# Altium project FMCW-Radar-v1.PrjPcb (part 3 of 3)

## Sheet MCU.SchDoc
size B; SheetNumber: 4; SheetTotal: 4
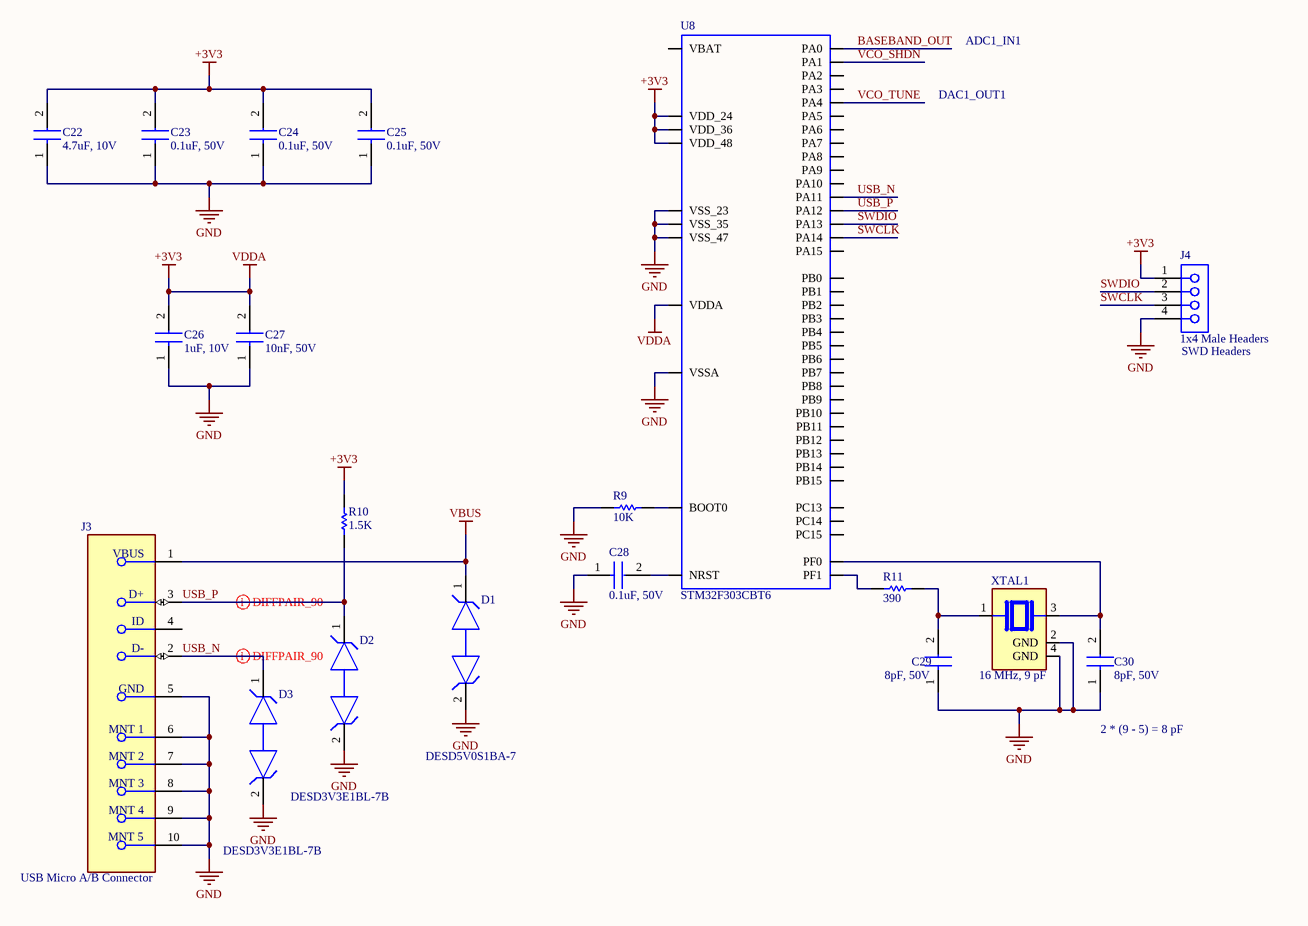
[diagram p3: MCU.SchDoc]

### Parts
C22  4.7uF, 10V  [CAPC1608X90N]
C23  0.1uF, 50V  [CAP_CC0603_YAG-M]
C24  0.1uF, 50V  [CAP_CC0603_YAG-M]
C25  0.1uF, 50V  [CAP_CC0603_YAG-M]
C26  1uF, 10V  [FP-CL10-IPC_A]
C27  10nF, 50V  [CAPC10555_55N_KEM]
C28  0.1uF, 50V  [CAP_CC0603_YAG-M]
C29  8pF, 50V  [CAPC1005X55N]
C30  8pF, 50V  [CAPC1005X55N]
D1  DESD5V0S1BA-7  [FP-SOD323-IPC_C]
D2  DESD3V3E1BL-7B  [CR_X1-DFN1006-2_DIO]
D3  DESD3V3E1BL-7B  [CR_X1-DFN1006-2_DIO]
J3  USB Micro A/B Connector  [FP-47590-0001-MFG]
J4  1x4 Male Headers  [61300411121]
R9  10K  [RESC1005X37N]
R10  1.5K  [RESC1005X40N]
R11  390  [RESC1005X40N]
U8  STM32F303CBT6  [LQFP-48]
XTAL1  16 MHz, 9 pF  [XTAL_TSX-3225_16.0000MF18X-AC0]

### Nets
+3V3: C22.2 C23.2 C24.2 C25.2 C26.2 C27.2 J4.1 R10.1 U8.9(VDDA) U8.24(VDD_24) U8.36(VDD_36) U8.48(VDD_48)  [also labelled VDDA]
GND: C22.1 C23.1 C24.1 C25.1 C26.1 C27.1 C28.1 C29.1 C30.1 D1.2 D2.2 D3.2 J3.5(GND) J3.6(MNT_1) J3.7(MNT_2) J3.8(MNT_3) J3.9(MNT_4) J3.10(MNT_5) J4.4 R9.1 U8.8(VSSA) U8.23(VSS_23) U8.35(VSS_35) U8.47(VSS_47) XTAL1.2(GND) XTAL1.4(GND)
VBUS: D1.1 J3.1(VBUS)
BASEBAND_OUT: U8.10(PA0)
SWCLK: J4.3 U8.37(PA14)
SWDIO: J4.2 U8.34(PA13)
USB_N: D3.1 J3.2(D-) U8.32(PA11)
USB_P: D2.1 J3.3(D+) R10.2 U8.33(PA12)
VCO_SHDN: U8.11(PA1)
VCO_TUNE: U8.14(PA4)
NetC28_2: C28.2 U8.7(NRST)
NetC29_2: C29.2 R11.2 XTAL1.1
NetC30_2: C30.2 U8.5(PF0) XTAL1.3
NetR9_2: R9.2 U8.44(BOOT0)
NetR11_1: R11.1 U8.6(PF1)

Not connected (* = marked no-connect by the designer): J3 4(ID); U8 1(VBAT) 2(PC13) 3(PC14) 4(PC15) 12(PA2) 13(PA3) 15(PA5) 16(PA6) 17(PA7) 18(PB0) 19(PB1) 20(PB2) 21(PB10) 22(PB11) 25(PB12) 26(PB13) 27(PB14) 28(PB15) 29(PA8) 30(PA9) 31(PA10) 38(PA15) 39(PB3) 40(PB4) 41(PB5) 42(PB6) 43(PB7) 45(PB8) 46(PB9)

### Layout directives
differential pair; differential pair class USB: USB_N, USB_P

### Notes on the sheet
- DAC1_OUT1
- ADC1_IN1
- (near J4) SWD Headers
- 2 * (9 - 5) = 8 pF

### Library data of the parts
C22 = CL10A475KP8NNNC: Ceramic Capacitor, Multilayer, Ceramic, 10V, 10% +Tol, 10% -Tol, X5R, 15% TC, 4.7uF, Surface Mount, 0603; Manufacturer: Samsung; Multilayer: Yes; Supplier: Digikey; Supplier Part Number: 1276-1044-1-ND; Manufacturer Part Number: CL10A475KP8NNNC; RoHS: Yes; Category: Ceramic Capacitors; Stock: 5168989; Pricing: 1=0.08, 10=0.01, 100=0.008, 1000=0.0064 (USD); Mounting Technology: Surface Mount; Pins: 2; Dielectric Material: Ceramic; Package Shape: Rectangular; Case/Package: 0603; Terminal Finish: Nickel; Min Operating Temperature: -55°C; Max Operating Temperature: 85°C; JESD-609 Code: e3; Value: 4.7uF; Capacitor Type: Ceramic; Tolerance  (fill in as +-): 10%; Package Style: SMTMeter; Packaging: Tape and Reel; Tolerance (fill in as +-): 10%; Rated DC Voltage (URdc): 10V; Temperature Characteristics Code: X5R; Termination: Wraparound; Length: 1.6mm; Width: 0.8mm; Height: 0.5mm; Reach SVHC Compliant: Yes; RoHS Compliant: Yes; ComponentLink1URL: https://datasheet.ciiva.com:443/pdfs/VipMasterIC/IC/SEMS/SEMS-S-A0008521003/SEMS-S-A0008520862-1.pdf?src-supplier=IHS+Markit; ComponentLink1Description: https://datasheet.ciiva.com:443/pdfs/VipMasterIC/IC/SEMS/SEMS-S-A0008521003/SEMS-S-A0008520862-1.pdf?src-supplier=IHS+Markit; ComponentLink2URL: https://datasheet.ciiva.com/25797/cl10a475kp8nnnc-25797520.pdf?src-supplier=Digikey; ComponentLink2Description: https://datasheet.ciiva.com/25797/cl10a475kp8nnnc-25797520.pdf?src-supplier=Digikey; ComponentLink3URL: https://datasheet.ciiva.com/26838/getdatasheetpartid-358676-26838384.pdf?src-supplier=Verical; ComponentLink3Description: https://datasheet.ciiva.com/26838/getdatasheetpartid-358676-26838384.pdf?src-supplier=Verical; ComponentLink4URL: https://datasheet.ciiva.com/16318/cl05b104kq5nnnc-16318245.pdf?src-supplier=Future+Electronics; ComponentLink4Description: https://datasheet.ciiva.com/16318/cl05b104kq5nnnc-16318245.pdf?src-supplier=Future+Electronics
C23-C25 C28 = CC0603JRX7R9BB104: Ceramic Capacitor, Multilayer, Ceramic, 50V, 5% +Tol, 5% -Tol, X7R, 15% TC, 0.1uF, Surface Mount, 0603; Manufacturer: Yageo; Value: 100nF; Multilayer: Yes; Supplier: Digikey; Supplier Part Number: 311-1779-1-ND; Manufacturer Part Number: CC0603JRX7R9BB104; RoHS: Yes; Category: Ceramic Capacitors; Stock: 91480; Pricing: 1=0.1, 10=0.05, 100=0.0297, 1000=0.01795 (USD); Mounting Technology: Surface Mount; Pins: 2; Dielectric Material: Ceramic; Package Shape: Rectangular; Case/Package: 0603; Terminal Finish: Nickel; Min Operating Temperature: -55°C; Max Operating Temperature: 125°C; JESD-609 Code: e3; Capacitor Type: Ceramic; Tolerance  (fill in as +-): 5%; Package Style: SMTMeter; Packaging: Tape and Reel; Tolerance (fill in as +-): 5%; Rated DC Voltage (URdc): 50V; Temperature Characteristics Code: X7R; Termination: Wraparound; Length: 1.6mm; Width: 0.8mm; Height: 0.8mm; Reach SVHC Compliant: Yes; RoHS Compliant: Yes; ComponentLink1URL: https://datasheet.ciiva.com:443/pdfs/VipMasterIC/IC/YAGO/YAGO-S-A0003557223/YAGO-S-A0003557223-1.pdf?src-supplier=IHS+Markit; ComponentLink1Description: https://datasheet.ciiva.com:443/pdfs/VipMasterIC/IC/YAGO/YAGO-S-A0003557223/YAGO-S-A0003557223-1.pdf?src-supplier=IHS+Markit; ComponentLink2URL: https://datasheet.ciiva.com/11465/upy-gphc-x7r-6-3v-to-50v-8-11465038.pdf?src-supplier=Avnet; ComponentLink2Description: https://datasheet.ciiva.com/11465/upy-gphc-x7r-6-3v-to-50v-8-11465038.pdf?src-supplier=Avnet
C26 = CL10B105KP8NNNC: Ceramic Capacitor, Multilayer, Ceramic, 10V, 10% +Tol, 10% -Tol, X7R, 15% TC, 1uF, Surface Mount, 0603; Manufacturer: Samsung; Multilayer: Yes; Supplier: Digikey; Supplier Part Number: 1276-1946-6-ND; Manufacturer Part Number: CL10B105KP8NNNC; RoHS: Yes; Category: Ceramic Capacitors; Stock: 5561968; Pricing: 1=0.08, 10=0.006, 100=0.0056, 1000=0.00528 (USD); Mounting Technology: Surface Mount; Pins: 2; Dielectric Material: Ceramic; Package Shape: Rectangular; Case/Package: 0603; Terminal Finish: Nickel; Min Operating Temperature: -55°C; Max Operating Temperature: 125°C; JESD-609 Code: e3; Value: 1uF; Capacitor Type: Ceramic; Tolerance  (fill in as +-): 10%; Package Style: SMTMeter; Packaging: Tape and Reel; Tolerance (fill in as +-): 10%; Rated DC Voltage (URdc): 10V; Temperature Characteristics Code: X7R; Termination: Wraparound; Length: 1.6mm; Width: 0.8mm; Height: 0.9mm; Reach SVHC Compliant: Yes; RoHS Compliant: Yes; ComponentLink1URL: https://datasheet.ciiva.com:443/pdfs/VipMasterIC/IC/SEMS/SEMS-S-A0008526420/SEMS-S-A0008526450-1.pdf?src-supplier=IHS+Markit; ComponentLink1Description: https://datasheet.ciiva.com:443/pdfs/VipMasterIC/IC/SEMS/SEMS-S-A0008526420/SEMS-S-A0008526450-1.pdf?src-supplier=IHS+Markit; ComponentLink2URL: https://datasheet.ciiva.com/25788/cl10b105kp8nnnc-25788304.pdf?src-supplier=Digikey; ComponentLink2Description: https://datasheet.ciiva.com/25788/cl10b105kp8nnnc-25788304.pdf?src-supplier=Digikey; ComponentLink3URL: https://datasheet.ciiva.com/26838/getdatasheetpartid-358410-26838426.pdf?src-supplier=Verical; ComponentLink3Description: https://datasheet.ciiva.com/26838/getdatasheetpartid-358410-26838426.pdf?src-supplier=Verical; ComponentLink4URL: https://datasheet.ciiva.com/16396/cl10b105kp8nnnc-16396970.pdf?src-supplier=Future+Electronics; ComponentLink4Description: https://datasheet.ciiva.com/16396/cl10b105kp8nnnc-16396970.pdf?src-supplier=Future+Electronics
C27 = C0402C103K5RACTU: Ceramic Capacitor, Multilayer, Ceramic, 50V, 10% +Tol, 10% -Tol, X7R, 15% TC, 0.01uF, Surface Mount, 0402; Manufacturer: KEMET; Multilayer: Yes; Supplier: Digikey; Supplier Part Number: 399-C0402C103K5RACTUDKR-ND; Manufacturer Part Number: C0402C103K5RACTU; RoHS: Yes; Category: Ceramic Capacitors; Stock: 862179; Pricing: 1=0.08, 10=0.005, 100=0.0043 (USD); Mounting Technology: Surface Mount; Pins: 2; Dielectric Material: Ceramic; Package Shape: Rectangular; Case/Package: 0402; Terminal Finish: Nickel; Min Operating Temperature: -55°C; Max Operating Temperature: 125°C; JESD-609 Code: e3; Value: 10nF; Capacitor Type: Ceramic; Tolerance  (fill in as +-): 10%; Package Style: SMTMeter; Packaging: Tape and Reel; Tolerance (fill in as +-): 10%; Rated DC Voltage (URdc): 50V; Temperature Characteristics Code: X7R; Termination: Wraparound; Length: 1mm; Width: 0.5mm; Height: 0.5mm; Reach SVHC Compliant: Yes; RoHS Compliant: Yes; ComponentLink1URL: https://datasheet.ciiva.com:443/pdfs/VipMasterIC/IC/KEME/KEME-S-A0008991654/KEME-S-A0008991654-1.pdf?src-supplier=IHS+Markit; ComponentLink1Description: https://datasheet.ciiva.com:443/pdfs/VipMasterIC/IC/KEME/KEME-S-A0008991654/KEME-S-A0008991654-1.pdf?src-supplier=IHS+Markit; ComponentLink2URL: https://datasheet.ciiva.com/45846/docfinderpartnumberc0402c102k5ractu-45846918.pdf?src-supplier=Onlinecomponents.com; ComponentLink2Description: https://datasheet.ciiva.com/45846/docfinderpartnumberc0402c102k5ractu-45846918.pdf?src-supplier=Onlinecomponents.com
C29 C30 = GJM1555C1H8R0BB01D: Ceramic Capacitor, Multilayer, Ceramic, 50V, 1.25% +Tol, 1.25% -Tol, C0G, 30ppm/Cel TC, 0.000008uF, Surface Mount, 0402; Manufacturer: Murata; Multilayer: Yes; Supplier: Digikey; Supplier Part Number: 490-11238-1-ND; Manufacturer Part Number: GJM1555C1H8R0BB01D; RoHS: Yes; Category: Ceramic Capacitors; Stock: 33111; Pricing: 1=0.1, 10=0.052, 100=0.0307, 1000=0.01991 (USD); Mounting Technology: Surface Mount; Pins: 2; Dielectric Material: Ceramic; Package Shape: Rectangular; Case/Package: 0402; Terminal Finish: Nickel; Min Operating Temperature: -55°C; Max Operating Temperature: 125°C; JESD-609 Code: e3; Value: 8pF; Capacitor Type: Ceramic; Tolerance  (fill in as +-): 1.25%; Package Style: SMTMeter; Packaging: Tape and Reel; Tolerance (fill in as +-): 1.25%; Rated DC Voltage (URdc): 50V; Temperature Characteristics Code: C0G; Termination: Wraparound; Length: 1mm; Width: 0.5mm; Height: 0.5mm; Reach SVHC Compliant: Yes; RoHS Compliant: Yes; ComponentLink1URL: https://datasheet.ciiva.com:443/pdfs/VipMasterIC/IC/MURE/MURE-S-A0004378008/MURE-S-A0004383112-1.pdf?src-supplier=IHS+Markit; ComponentLink1Description: https://datasheet.ciiva.com:443/pdfs/VipMasterIC/IC/MURE/MURE-S-A0004378008/MURE-S-A0004383112-1.pdf?src-supplier=IHS+Markit; ComponentLink2URL: https://datasheet.ciiva.com/11610/product-11610188.pdf?src-supplier=Avnet; ComponentLink2Description: https://datasheet.ciiva.com/11610/product-11610188.pdf?src-supplier=Avnet
D1 = DESD5V0S1BA-7: Trans Voltage Suppressor Diode, 130W, 5V V(RWM), Bidirectional, 2 Element, Silicon; Manufacturer: Diodes Zetex; Package Body Material: Plastic; Max Breakdown Voltage: 9.5V; Min Breakdown Voltage: 5.5V; Breakdown Voltage-Nom: 7.5V; Clamping Voltage-Max: 14V; Number of Elements: 2; Max Power Dissipation: 200mW; Time @ Peak Reflow Temperature-Max (s): 40s; Reference Standard: IEC-61000-4-5; Supplier: Digikey; Supplier Part Number: DESD5V0S1BA-7DICT-ND; Manufacturer Part Number: DESD5V0S1BA-7; RoHS: Yes; Category: TVS Diodes; Stock: 799643; Pricing: 1=0.1, 10=0.066, 100=0.05 (USD); Pins: 2; Diode Element Material: SILICON; Package Shape: Rectangular; Terminal Finish: Tin; Min Operating Temperature: -65°C; Max Operating Temperature: 150°C; JESD-609 Code: e3; Polarity: Bidirectional; Diode Type: TRANS VOLTAGE SUPPRESSOR; JESD-30 Code: R-PDSO-G2; Moisture Sensitivity Level: 1; Non-rep Peak Rev Power Dis-Max: 130W; Package Style: SMALL OUTLINEMeter; Peak Reflow Temperature (Cel): 260°C; Rep Pk Reverse Voltage-Max: 5V; Surface Mount: Yes; Technology: AVALANCHE; Terminal Form: Gull Wing; Terminal Position: DUAL; Reach SVHC Compliant: Yes; RoHS Compliant: Yes; ComponentLink1URL: https://datasheet.ciiva.com:443/pdfs/VipMasterIC/IC/DIOD/DIODS15480/DIODS15480-1.pdf?src-supplier=IHS+Markit; ComponentLink1Description: https://datasheet.ciiva.com:443/pdfs/VipMasterIC/IC/DIOD/DIODS15480/DIODS15480-1.pdf?src-supplier=IHS+Markit; ComponentLink2URL: https://datasheet.ciiva.com/6574/ds31275-6574481.pdf?src-supplier=Digikey; ComponentLink2Description: https://datasheet.ciiva.com/6574/ds31275-6574481.pdf?src-supplier=Digikey; ComponentLink3URL: https://datasheet.ciiva.com/13078/ds31275-219185-13078529.pdf?src-supplier=Mouser; ComponentLink3Description: https://datasheet.ciiva.com/13078/ds31275-219185-13078529.pdf?src-supplier=Mouser; ComponentLink4URL: https://datasheet.ciiva.com/30478/0900766b8115c371-30478883.pdf?src-supplier=Rs; ComponentLink4Description: https://datasheet.ciiva.com/30478/0900766b8115c371-30478883.pdf?src-supplier=Rs; ComponentLink5URL: https://datasheet.ciiva.com/15186/getdatasheetpartid-662239-15186712.pdf?src-supplier=Verical; ComponentLink5Description: https://datasheet.ciiva.com/15186/getdatasheetpartid-662239-15186712.pdf?src-supplier=Verical
D2 D3 = DESD3V3E1BL-7B: Trans Voltage Suppressor Diode, 35W, 3.3V V(RWM), Bidirectional, 1 Element, Silicon; Manufacturer: Diodes; Supplier: Digikey; Supplier Part Number: 31-DESD3V3E1BL-7BCT-ND; Manufacturer Part Number: DESD3V3E1BL-7B; RoHS: Yes; Category: TVS Diodes; Stock: 131192; Pricing: 1=0.12, 10=0.083, 100=0.034, 500=0.033, 1000=0.031, 2000=0.0305, 5000=0.03 (USD); ComponentLink1URL: https://datasheet.ciiva.com:443/pdfs/VipMasterIC/IC/DIOD/DIOD-S-A0007810551/DIOD-S-A0007810551-1.pdf?src-supplier=IHS+Markit; ComponentLink1Description: https://datasheet.ciiva.com:443/pdfs/VipMasterIC/IC/DIOD/DIOD-S-A0007810551/DIOD-S-A0007810551-1.pdf?src-supplier=IHS+Markit; ComponentLink2URL: https://datasheet.octopart.com/DESD3V3E1BL-7B-Diodes-Inc.-datasheet-151210080.pdf?src-supplier=Farnell; ComponentLink2Description: https://datasheet.octopart.com/DESD3V3E1BL-7B-Diodes-Inc.-datasheet-151210080.pdf?src-supplier=Farnell; ComponentLink3URL: https://datasheet.octopart.com/DESD3V3E1BL-7B-Diodes-Inc.-datasheet-151210080.pdf?src-supplier=Newark; ComponentLink3Description: https://datasheet.octopart.com/DESD3V3E1BL-7B-Diodes-Inc.-datasheet-151210080.pdf?src-supplier=Newark; ComponentLink4URL: https://www.diodes.com/assets/Datasheets/DESD3V3E1BL.pdf?src-supplier=Digikey; ComponentLink4Description: https://www.diodes.com/assets/Datasheets/DESD3V3E1BL.pdf?src-supplier=Digikey
J3 = 47590-0001: USB Connector, 5 Contact(s), Female, Right Angle, Surface Mount Terminal, Locking, Receptacle; Manufacturer: Molex; Connector Type: TELECOM AND DATACOM CONNECTOR; Option: General Purpose; Additional Feature: Shielded; Board Mounting Option: PEG; Contact Resistance: 30mR; Dielectric Withstanding Voltage (AC): 141V; Durability: 10000Cycles; Empty Shell: No; Insulation Resistance: 1GR; Number Of Connectors: 1; PCB Contact Pattern: RECTANGULAR; Polarization Key: POLAR PIN POSITION; Rated Current (Signal): 1A; Number of Contacts: 5; Body Breadth: 0.118inch; Body Depth: 0.232inch; Body Length: 0.295inch; Reference Standard: UL; Reliability: COMMERCIAL; Supplier: Digikey; Supplier Part Number: WM17144TR-ND; Manufacturer Part Number: 47590-0001; RoHS: Yes; Category: USB Connectors; Stock: 34500; Pricing: 1500=0.44663, 3000=0.42531, 4500=0.41332, 7500=0.39869, 10500=0.38935, 15000=0.37968 (USD); Mounting Technology: Cable; Contact Material: Copper Alloy; Contact Finish - Mating: GOLD; Contact Finish - Termination: Gold (Au); Insulation Material: Polymer; Shell Finish: Tin; Shell Material: Stainless Steel; Min Operating Temperature: -30°C; Max Operating Temperature: 85°C; JESD-609 Code: e4; Body/Shell Style: RECEPTACLE; Contact Gender: Female; Filter Feature: No; Mixed Contacts: No; Mounting Style: RIGHT ANGLE; Number Of PCB Rows: 1; Termination: SMD/SMT; Mounting Option 1: LOCKING; Terminal Pitch: 0.6604mm; Reach SVHC Compliant: Yes; RoHS Compliant: Yes; DIN Conformance: No; IEC Conformance: No; MIL Conformance: No; ComponentLink1URL: https://datasheet.ciiva.com:443/pdfs/VipMasterIC/IC/MOLE/MOLE-S-A0000442751/MOLE-S-A0000443003-1.pdf?src-supplier=IHS+Markit; ComponentLink1Description: https://datasheet.ciiva.com:443/pdfs/VipMasterIC/IC/MOLE/MOLE-S-A0000442751/MOLE-S-A0000443003-1.pdf?src-supplier=IHS+Markit; ComponentLink2URL: https://datasheet.ciiva.com/11731/0900766b80dfe0a6-11731294.pdf?src-supplier=Rs; ComponentLink2Description: https://datasheet.ciiva.com/11731/0900766b80dfe0a6-11731294.pdf?src-supplier=Rs; ComponentLink3URL: https://datasheet.ciiva.com/1098/1597781-1098479.pdf?src-supplier=Element14; ComponentLink3Description: https://datasheet.ciiva.com/1098/1597781-1098479.pdf?src-supplier=Element14; ComponentLink4URL: https://datasheet.ciiva.com/30249/0475900001-io-connectors-30249603.pdf?src-supplier=Onlinecomponents.com; ComponentLink4Description: https://datasheet.ciiva.com/30249/0475900001-io-connectors-30249603.pdf?src-supplier=Onlinecomponents.com; ComponentLink5URL: https://datasheet.ciiva.com/26930/getdatasheetpartid-760223-26930053.pdf?src-supplier=Verical; ComponentLink5Description: https://datasheet.ciiva.com/26930/getdatasheetpartid-760223-26930053.pdf?src-supplier=Verical; ComponentLink6URL: https://datasheet.ciiva.com/16148/0475900001-io-connectors-16148922.pdf?src-supplier=Onlinecomponents.com; ComponentLink6Description: https://datasheet.ciiva.com/16148/0475900001-io-connectors-16148922.pdf?src-supplier=Onlinecomponents.com
J4 = 61300411121: Board Connector, 4 Contact(s), 1 Row(s), Male, Straight, 0.1 inch Pitch, Solder Terminal, Locking, Black Insulator, Plug; Manufacturer: Wurth Electronics; Contact Pattern: RECTANGULAR; Contact Resistance: 20mR; Contact Style: SQ PIN-SKT; Dielectric Withstanding Voltage (AC): 500V; Insulation Resistance: 1GR; Number Of Connectors: 1; Rated Current (Signal): 3A; Number of Contacts: 4; Body Length: 0.4inch; Reference Standard: UL; Reliability: COMMERCIAL; Supplier: Digikey; Supplier Part Number: 732-5317-ND; Manufacturer Part Number: 61300411121; RoHS: Yes; Category: Headers and Wire Housings; Stock: 73347; Pricing: 1=0.17, 10=0.147, 25=0.1216, 50=0.1018, 100=0.0918, 1000=0.085 (USD); Mounting Technology: Board; Contact Material: Copper Alloy; Contact Finish - Mating: GOLD; Contact Finish - Termination: Gold (Au) - with Nickel (Ni) barrier; Insulation Color: Black; Insulation Material: Polybutylene; Min Operating Temperature: -40°C; Max Operating Temperature: 125°C; Connector Type: BOARD CONNECTOR; JESD-609 Code: e4; Body/Shell Style: PLUG; Contact Gender: Male; Mounting Style: STRAIGHT; Number of Rows Loaded: 1; PCB Contact Pattern: RECTANGULAR; Termination: Solder; Body Breadth: 0.1inch; Body Depth: 0.1inch; Mating Contact Pitch: 0.1inch; Mounting Option 1: LOCKING; Terminal Length: 0.118inch; Terminal Pitch: 2.54mm; Reach SVHC Compliant: Yes; RoHS Compliant: Yes; ComponentLink1URL: https://datasheet.ciiva.com:443/pdfs/VipMasterIC/IC/MIDC/MIDCS07676/MIDCS07676-1.pdf?src-supplier=IHS+Markit; ComponentLink1Description: https://datasheet.ciiva.com:443/pdfs/VipMasterIC/IC/MIDC/MIDCS07676/MIDCS07676-1.pdf?src-supplier=IHS+Markit; ComponentLink2URL: https://datasheet.octopart.com/61300411121-W%C3%BCrth-Elektronik-datasheet-21154836.pdf?src-supplier=Element14; ComponentLink2Description: https://datasheet.octopart.com/61300411121-W%C3%BCrth-Elektronik-datasheet-21154836.pdf?src-supplier=Element14; ComponentLink3URL: http://www.farnell.com/cad/1737268.pdf?src-supplier=Element14; ComponentLink3Description: http://www.farnell.com/cad/1737268.pdf?src-supplier=Element14; ComponentLink4URL: https://katalog.we-online.de/em/datasheet/6130xx11121.pdf?src-supplier=Digikey; ComponentLink4Description: https://katalog.we-online.de/em/datasheet/6130xx11121.pdf?src-supplier=Digikey
R9 = AC0402FR-0710KL: Fixed Resistor, Metal Glaze/thick Film, 0.0625W, 10000ohm, 50V, 1% +/-Tol, 100ppm/Cel, Surface Mount, 0402; Manufacturer: Yageo; Additional Feature: LASER TRIMMABLE; Power: 62.5mW; Rated Temperature: 70°C; Value: 10kR; Temperature Coefficient (ppm/Cel): 100; Package Height: 0.32mm; Package Length: 1mm; Package Width: 0.5mm; Reference Standard: AEC-Q200; Supplier: Digikey; Supplier Part Number: YAG3436CT-ND; Manufacturer Part Number: AC0402FR-0710KL; RoHS: Yes; Category: Chip SMD Resistors; Stock: 889565; Pricing: 1=0.1, 10=0.009, 100=0.0082, 1000=0.00612, 2500=0.0051, 5000=0.00407 (USD); Mounting Technology: Surface Mount; Pins: 2; Package Shape: Rectangular; Case/Package: 0402; Terminal Finish: Nickel; Min Operating Temperature: -55°C; Max Operating Temperature: 155°C; Tolerance: 1%; JESD-609 Code: e3; Resistor Type: FIXED RESISTOR; Construction: Chip; Packaging: Tape and Reel; Technology: METAL GLAZE/THICK FILM; Termination: Wraparound; Working Voltage: 50V; Reach SVHC Compliant: Yes; RoHS Compliant: Yes; ComponentLink1URL: https://datasheet.ciiva.com:443/pdfs/VipMasterIC/IC/YAGO/YAGO-S-A0003597364/YAGO-S-A0003597364-1.pdf?src-supplier=IHS+Markit; ComponentLink1Description: https://datasheet.ciiva.com:443/pdfs/VipMasterIC/IC/YAGO/YAGO-S-A0003597364/YAGO-S-A0003597364-1.pdf?src-supplier=IHS+Markit; ComponentLink2URL: https://datasheet.ciiva.com/12656/pyu-ac-51-rohs-l-2-12656634.pdf?src-supplier=Mouser; ComponentLink2Description: https://datasheet.ciiva.com/12656/pyu-ac-51-rohs-l-2-12656634.pdf?src-supplier=Mouser
R10 = RC0402FR-071K5L: Fixed Resistor, Metal Glaze/thick Film, 0.0625W, 1500ohm, 50V, 1% +/-Tol, 100ppm/Cel, Surface Mount, 0402; Manufacturer: Yageo; Additional Feature: LASER TRIMMABLE; Power: 62.5mW; Rated Temperature: 70°C; Value: 1.5kR; Temperature Coefficient (ppm/Cel): 100; Package Height: 0.35mm; Package Length: 1mm; Package Width: 0.5mm; Supplier: Digikey; Supplier Part Number: 311-1.50KLRCT-ND; Manufacturer Part Number: RC0402FR-071K5L; RoHS: Yes; Category: Chip SMD Resistors; Stock: 344101; Pricing: 1=0.1, 10=0.013, 100=0.0061, 1000=0.0051, 2500=0.00306, 10000=0.00306, 20000=0.00204, 30000=0.0017, 50000=0.00161 (USD); Mounting Technology: Surface Mount; Pins: 2; Package Shape: Rectangular; Case/Package: 0402; Terminal Finish: Nickel; Min Operating Temperature: -55°C; Max Operating Temperature: 155°C; Tolerance: 1%; JESD-609 Code: e3; Resistor Type: FIXED RESISTOR; Construction: Chip; Packaging: Tape and Reel; Technology: METAL GLAZE/THICK FILM; Termination: Wraparound; Working Voltage: 50V; Reach SVHC Compliant: Yes; RoHS Compliant: Yes; ComponentLink1URL: https://datasheet.ciiva.com:443/pdfs/VipMasterIC/IC/YAGO/YAGO-S-A0008145938/YAGO-S-A0008145938-1.pdf?src-supplier=IHS+Markit; ComponentLink1Description: https://datasheet.ciiva.com:443/pdfs/VipMasterIC/IC/YAGO/YAGO-S-A0008145938/YAGO-S-A0008145938-1.pdf?src-supplier=IHS+Markit; ComponentLink2URL: https://datasheet.ciiva.com/11808/0900766b80c66297-11808238.pdf?src-supplier=Rs; ComponentLink2Description: https://datasheet.ciiva.com/11808/0900766b80c66297-11808238.pdf?src-supplier=Rs; ComponentLink3URL: https://datasheet.ciiva.com/7849/1018594-7849863.pdf?src-supplier=Element14; ComponentLink3Description: https://datasheet.ciiva.com/7849/1018594-7849863.pdf?src-supplier=Element14; ComponentLink4URL: https://datasheet.ciiva.com/7849/1018594-7849864.pdf?src-supplier=Element14; ComponentLink4Description: https://datasheet.ciiva.com/7849/1018594-7849864.pdf?src-supplier=Element14; ComponentLink5URL: https://datasheet.ciiva.com/2453/pyu-r-int-thick-7-2453439.pdf?src-supplier=Digikey; ComponentLink5Description: https://datasheet.ciiva.com/2453/pyu-r-int-thick-7-2453439.pdf?src-supplier=Digikey; ComponentLink6URL: https://datasheet.ciiva.com/2453/pyu-r-int-thick-7-2453440.pdf?src-supplier=Digikey; ComponentLink6Description: https://datasheet.ciiva.com/2453/pyu-r-int-thick-7-2453440.pdf?src-supplier=Digikey; ComponentLink7URL: https://datasheet.ciiva.com/2453/pyu-r-int-thick-7-2453441.pdf?src-supplier=Digikey; ComponentLink7Description: https://datasheet.ciiva.com/2453/pyu-r-int-thick-7-2453441.pdf?src-supplier=Digikey; ComponentLink8URL: https://datasheet.ciiva.com/12558/pyu-rc0402-51-rohs-l-6-r-8721-12558542.pdf?src-supplier=Mouser; ComponentLink8Description: https://datasheet.ciiva.com/12558/pyu-rc0402-51-rohs-l-6-r-8721-12558542.pdf?src-supplier=Mouser; ComponentLink9URL: https://datasheet.ciiva.com/46394/1018594-46394950.pdf?src-supplier=Element14; ComponentLink9Description: https://datasheet.ciiva.com/46394/1018594-46394950.pdf?src-supplier=Element14; ComponentLink10URL: https://datasheet.ciiva.com/15189/getdatasheetpartid-323992-15189370.pdf?src-supplier=Verical; ComponentLink10Description: https://datasheet.ciiva.com/15189/getdatasheetpartid-323992-15189370.pdf?src-supplier=Verical
R11 = RC0402JR-07390RL: Fixed Resistor, Metal Glaze/thick Film, 0.0625W, 390ohm, 50V, 5% +/-Tol, 100ppm/Cel, Surface Mount, 0402; Manufacturer: Yageo; Additional Feature: LASER TRIMMABLE; Power: 62.5mW; Rated Temperature: 70°C; Value: 390R; Temperature Coefficient (ppm/Cel): 100; Package Height: 0.35mm; Package Length: 1mm; Package Width: 0.5mm; Supplier: Digikey; Supplier Part Number: 311-390JRCT-ND; Manufacturer Part Number: RC0402JR-07390RL; RoHS: Yes; Category: Chip SMD Resistors; Stock: 313047; Pricing: 1=0.1, 10=0.007, 50=0.0066, 100=0.0061, 500=0.0051, 1000=0.00408, 5000=0.00284 (USD); Mounting Technology: Surface Mount; Pins: 2; Package Shape: Rectangular; Case/Package: 0402; Terminal Finish: Nickel; Min Operating Temperature: -55°C; Max Operating Temperature: 155°C; Tolerance: 5%; JESD-609 Code: e3; Resistor Type: FIXED RESISTOR; Construction: Chip; Packaging: Tape and Reel; Technology: METAL GLAZE/THICK FILM; Termination: Wraparound; Working Voltage: 50V; Reach SVHC Compliant: Yes; RoHS Compliant: Yes; ComponentLink1URL: https://datasheet.ciiva.com:443/pdfs/VipMasterIC/IC/YAGO/YAGO-S-A0008145938/YAGO-S-A0008145938-1.pdf?src-supplier=IHS+Markit; ComponentLink1Description: https://datasheet.ciiva.com:443/pdfs/VipMasterIC/IC/YAGO/YAGO-S-A0008145938/YAGO-S-A0008145938-1.pdf?src-supplier=IHS+Markit; ComponentLink2URL: https://datasheet.ciiva.com/7983/1018594-7983580.pdf?src-supplier=Element14; ComponentLink2Description: https://datasheet.ciiva.com/7983/1018594-7983580.pdf?src-supplier=Element14; ComponentLink3URL: https://datasheet.ciiva.com/7850/1018594-7850204.pdf?src-supplier=Element14; ComponentLink3Description: https://datasheet.ciiva.com/7850/1018594-7850204.pdf?src-supplier=Element14; ComponentLink4URL: https://datasheet.ciiva.com/7850/1018594-7850205.pdf?src-supplier=Element14; ComponentLink4Description: https://datasheet.ciiva.com/7850/1018594-7850205.pdf?src-supplier=Element14; ComponentLink5URL: https://datasheet.ciiva.com/12656/pyu-rc0402-51-rohs-l-6-r-12656651.pdf?src-supplier=Mouser; ComponentLink5Description: https://datasheet.ciiva.com/12656/pyu-rc0402-51-rohs-l-6-r-12656651.pdf?src-supplier=Mouser; ComponentLink6URL: https://datasheet.ciiva.com/2452/pyu-r-int-thick-7-2452668.pdf?src-supplier=Digikey; ComponentLink6Description: https://datasheet.ciiva.com/2452/pyu-r-int-thick-7-2452668.pdf?src-supplier=Digikey; ComponentLink7URL: https://datasheet.ciiva.com/2452/pyu-r-int-thick-7-2452669.pdf?src-supplier=Digikey; ComponentLink7Description: https://datasheet.ciiva.com/2452/pyu-r-int-thick-7-2452669.pdf?src-supplier=Digikey; ComponentLink8URL: https://datasheet.ciiva.com/2452/pyu-r-int-thick-7-2452670.pdf?src-supplier=Digikey; ComponentLink8Description: https://datasheet.ciiva.com/2452/pyu-r-int-thick-7-2452670.pdf?src-supplier=Digikey
U8 = STM32F303CBT6: RISC Microcontroller, 32-Bit, FLASH, CORTEX-M4F CPU, 72MHz, CMOS, PQFP48; Manufacturer: STMicroelectronics; Package Body Material: Plastic; Clock Frequency: 32MHz; Number of I/O Lines: 37; Package Equivalence Code: QFP48,.35SQ,20; Power Supplies: 2.5/3.3; Max Supply Voltage: 3.6V; Min Supply Voltage: 2V; Nominal Supply Voltage: 3.3V; Qualification Status: Not Qualified; Supplier: Digikey; Supplier Part Number: 497-17421-ND; Manufacturer Part Number: STM32F303CBT6; RoHS: Yes; Category: Microcontrollers; Stock: 6091; Pricing: 1=5.55, 10=4.266, 25=3.946, 100=3.5937, 250=3.44032 (USD); Case/Package: LFQFP; Pins: 48; Package Shape: Square; Terminal Finish: Tin; Min Operating Temperature: -40°C; Max Operating Temperature: 85°C; JESD-609 Code: e3; JESD-30 Code: S-PQFP-G48; Moisture Sensitivity Level: 3; Surface Mount: Yes; Technology: CMOS; Terminal Form: Gull Wing; Terminal Position: QUAD; Length: 7mm; Width: 7mm; Height - Seated (Max): 1.6mm; Terminal Pitch: 0.5mm; Temperature Grade: INDUSTRIAL; Reach SVHC Compliant: Yes; RoHS Compliant: Yes; ComponentLink1URL: https://datasheet.ciiva.com:443/pdfs/VipMasterIC/IC/SGST/SGST-S-A0001312473/SGST-S-A0001312473-1.pdf?src-supplier=IHS+Markit; ComponentLink1Description: https://datasheet.ciiva.com:443/pdfs/VipMasterIC/IC/SGST/SGST-S-A0001312473/SGST-S-A0001312473-1.pdf?src-supplier=IHS+Markit; ComponentLink2URL: https://datasheet.ciiva.com/22692/1831499-22692000.pdf?src-supplier=Element14; ComponentLink2Description: https://datasheet.ciiva.com/22692/1831499-22692000.pdf?src-supplier=Element14; ComponentLink3URL: https://datasheet.ciiva.com/29719/dm00058181-29719710.pdf?src-supplier=Digikey; ComponentLink3Description: https://datasheet.ciiva.com/29719/dm00058181-29719710.pdf?src-supplier=Digikey; ComponentLink4URL: https://datasheet.ciiva.com/24182/dm00058181-24182821.pdf?src-supplier=Future+Electronics; ComponentLink4Description: https://datasheet.ciiva.com/24182/dm00058181-24182821.pdf?src-supplier=Future+Electronics
XTAL1 = TSX-3225 16.0000MF18X-AC0: Parallel - Fundamental Quartz Crystal, 16MHz Nom; Manufacturer: Epson; Additional Feature: TAPE AND REEL; Aging: 1 PPM/FIRST YEAR; Drive Level: 1uW; Frequency Stability: 0.0018%; Frequency Tolerance: 10ppm; Load Capacitance: 9pF; Operating Frequency-Nom: 160; ESR: 60R; Supplier: Digikey; Supplier Part Number: SER4070CT-ND; Manufacturer Part Number: TSX-3225 16.0000MF18X-AC0; RoHS: Yes; Category: Crystals; Stock: 27034; Pricing: 1=0.39, 10=0.342, 50=0.3104, 100=0.2976, 500=0.26974 (USD); Mounting Technology: Surface Mount; Terminal Finish: Nickel; Min Operating Temperature: -40°C; Max Operating Temperature: 85°C; JESD-609 Code: e4; Crystal/Resonator Type: PARALLEL - FUNDAMENTAL; Reach SVHC Compliant: Yes; RoHS Compliant: Yes; ComponentLink1URL: https://datasheet.ciiva.com:443/pdfs/VipMasterIC/IC/SEIK/SEIKS02827/SEIKS02827-1.pdf?src-supplier=IHS+Markit; ComponentLink1Description: https://datasheet.ciiva.com:443/pdfs/VipMasterIC/IC/SEIK/SEIKS02827/SEIKS02827-1.pdf?src-supplier=IHS+Markit; ComponentLink2URL: https://www.eea.epson.com/wp-content/uploads/2016/11/November-2016-PCS-MASTER-BOOK.pdf?src-supplier=Verical; ComponentLink2Description: https://www.eea.epson.com/wp-content/uploads/2016/11/November-2016-PCS-MASTER-BOOK.pdf?src-supplier=Verical; ComponentLink3URL: https://www5.epsondevice.com/en/information/support/pdf/june_2018_psc_masterbook.pdf?src-supplier=Digikey; ComponentLink3Description: https://www5.epsondevice.com/en/information/support/pdf/june_2018_psc_masterbook.pdf?src-supplier=Digikey; ComponentLink4URL: https://datasheet.octopart.com/TSX-3225-16.0000MF18X-AC0-Epson-datasheet-61114919.pdf?src-supplier=Future+Electronics; ComponentLink4Description: https://datasheet.octopart.com/TSX-3225-16.0000MF18X-AC0-Epson-datasheet-61114919.pdf?src-supplier=Future+Electronics; ComponentLink5URL: https://www.eea.epson.com/wp-content/uploads/2016/11/November-2016-PCS-MASTER-BOOK.pdf?src-supplier=Mouser; ComponentLink5Description: https://www.eea.epson.com/wp-content/uploads/2016/11/November-2016-PCS-MASTER-BOOK.pdf?src-supplier=Mouser; ComponentLink6URL: https://datasheet.octopart.com/TSX-3225-16.0000MF18X-AC0-Epson-datasheet-140567378.pdf?src-supplier=Arrow.cn; ComponentLink6Description: https://datasheet.octopart.com/TSX-3225-16.0000MF18X-AC0-Epson-datasheet-140567378.pdf?src-supplier=Arrow.cn

## Nets that join several sheets
+3V3: Power (R1.2), Receiver-2.4GHz (R3.2 U7.8), MCU (12 pins)
+5V: Power (R2.2), Transmitter-2.4GHz (8 pins), Receiver-2.4GHz (C13.2 C14.2 C15.2 L2.1)
GND: Power (6 pins), Transmitter-2.4GHz (12 pins), Receiver-2.4GHz (13 pins), MCU (26 pins)
VBUS: Power (6 pins), MCU (D1.1 J3.1)
BASEBAND_OUT: Receiver-2.4GHz (C16.2 U7.6 U7.7), MCU (U8.10)
SPLT_TX_OUT: Transmitter-2.4GHz (U9.6), Receiver-2.4GHz (AT1.1)
VCO_SHDN: Transmitter-2.4GHz (U3.4), MCU (U8.11)
VCO_TUNE: Transmitter-2.4GHz (U3.2), MCU (U8.14)